# EAGLE design vaayu (EAGLE 6.6.0)
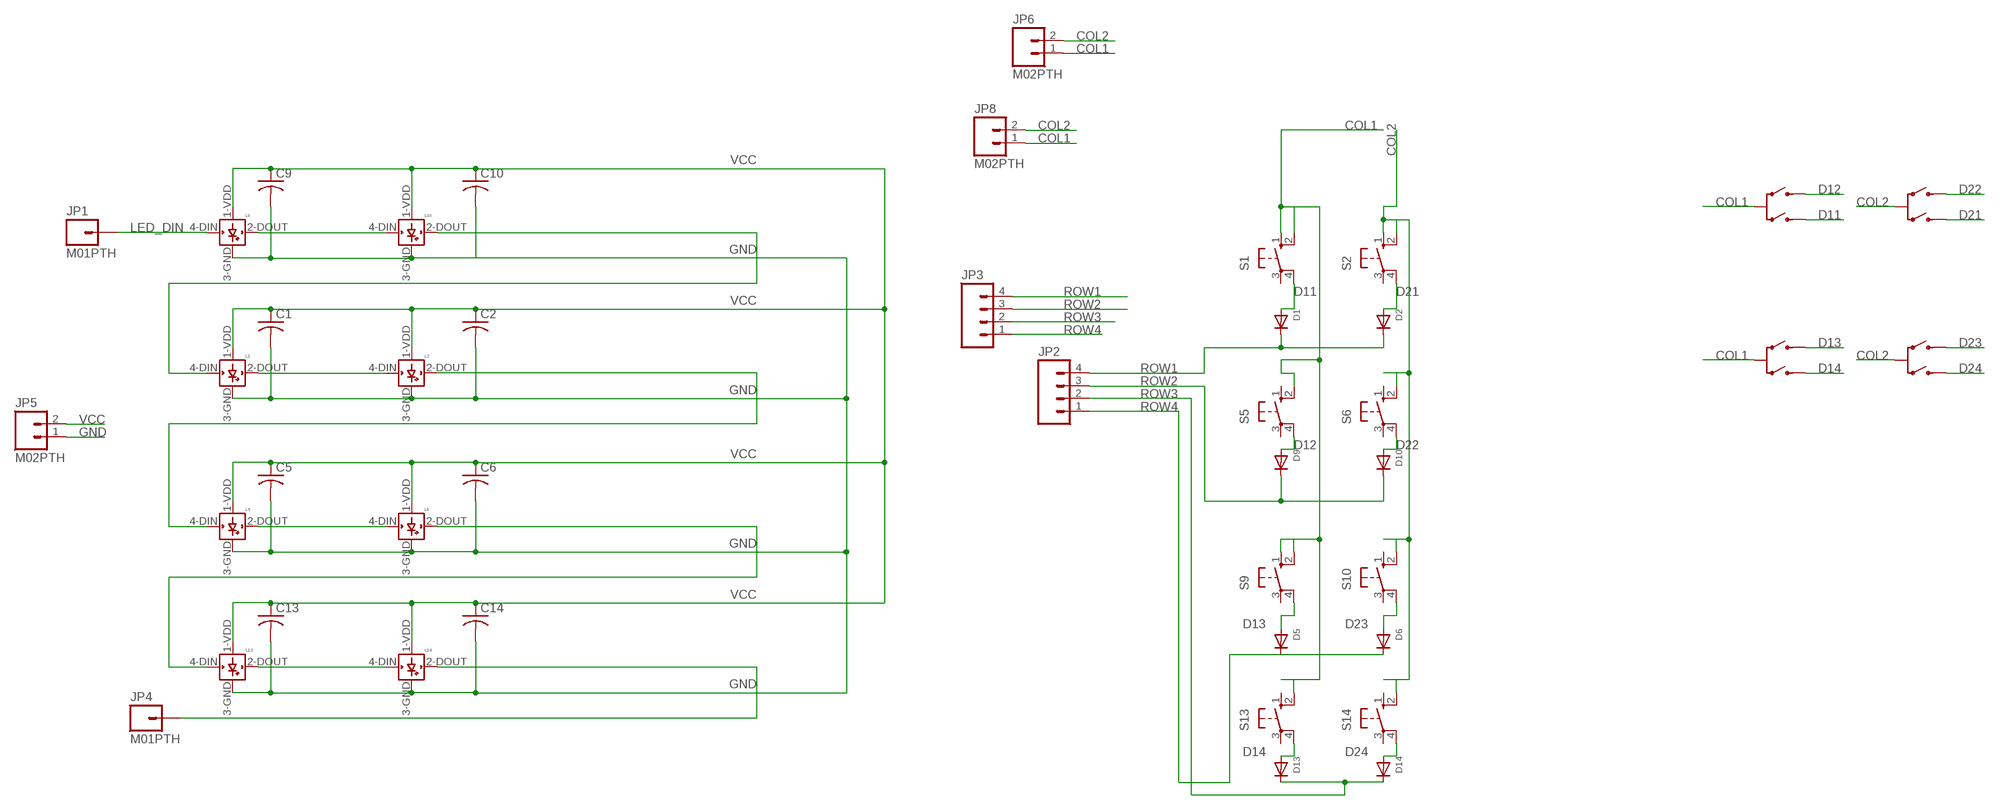
[diagram p0: schematic, sheet 1]

## Parts
C1  C-USC1206  [C1206]
C2  C-USC1206  [C1206]
C5  C-USC1206  [C1206]
C6  C-USC1206  [C1206]
C9  C-USC1206  [C1206]
C10  C-USC1206  [C1206]
C13  C-USC1206  [C1206]
C14  C-USC1206  [C1206]
D1  DIODESOD-123  [SOD-123]
D2  DIODESOD-123  [SOD-123]
D5  DIODESOD-123  [SOD-123]
D6  DIODESOD-123  [SOD-123]
D9  DIODESOD-123  [SOD-123]
D10  DIODESOD-123  [SOD-123]
D13  DIODESOD-123  [SOD-123]
D14  DIODESOD-123  [SOD-123]
JP1  M01PTH  [1X01]
JP2  M04PTH  [1X04]
JP3  M04PTH  [1X04]
JP4  M01PTH  [1X01]
JP5  M02PTH  [1X02]
JP6  M02PTH  [1X02]
JP8  M02PTH  [1X02]
L1  WS2812B  [WS2812B]
L2  WS2812B  [WS2812B]
L5  WS2812B  [WS2812B]
L6  WS2812B  [WS2812B]
L9  WS2812B  [WS2812B]
L10  WS2812B  [WS2812B]
L13  WS2812B  [WS2812B]
L14  WS2812B  [WS2812B]
S1  10-XX  [B3F-10XX]
S2  10-XX  [B3F-10XX]
S5  10-XX  [B3F-10XX]
S6  10-XX  [B3F-10XX]
S9  10-XX  [B3F-10XX]
S10  10-XX  [B3F-10XX]
S13  10-XX  [B3F-10XX]
S14  10-XX  [B3F-10XX]
U$1  ALPHA-ROT-ENCODER  [TW-700198]
U$4  ALPHA-ROT-ENCODER  [TW-700198]
U$5  ALPHA-ROT-ENCODER  [TW-700198]
U$8  ALPHA-ROT-ENCODER  [TW-700198]

## Nets
COL1: JP6.1 JP8.1 S1.1(S) S1.2(S1) S5.2(S1) S9.1(S) S9.2(S1) S13.2(S1) U$4.P2(COM) U$8.P2(COM)
COL2: JP6.2 JP8.2 S2.1(S) S2.2(S1) S6.2(S1) S10.2(S1) S14.2(S1) U$1.P2(COM) U$5.P2(COM)
D11: D1.A S1.4(P1) U$4.P1(B)
D12: D9.A S5.4(P1) U$4.P3(A)
D13: D5.A S9.4(P1) U$8.P3(A)
D14: D13.A S13.4(P1) U$8.P1(B)
D21: D2.A S2.4(P1) U$1.P1(B)
D22: D10.A S6.4(P1) U$1.P3(A)
D23: D6.A S10.4(P1) U$5.P3(A)
D24: D14.A S14.4(P1) U$5.P1(B)
GND: C1.2 C2.2 C5.2 C6.2 C9.2 C10.2 C13.2 C14.2 JP5.1 L1.3-GND(GND) L2.3-GND(GND) L5.3-GND(GND) L6.3-GND(GND) L9.3-GND(GND) L10.3-GND(GND) L13.3-GND(GND) L14.3-GND(GND)
LED_DIN: JP1.1 L9.4-DIN(DIN)
N$1: L1.2-DOUT(DOUT) L2.4-DIN(DIN)
N$4: L2.2-DOUT(DOUT) L5.4-DIN(DIN)
N$5: L5.2-DOUT(DOUT) L6.4-DIN(DIN)
N$6: L6.2-DOUT(DOUT) L13.4-DIN(DIN)
N$9: L13.2-DOUT(DOUT) L14.4-DIN(DIN)
N$10: JP4.1 L14.2-DOUT(DOUT)
N$23: L9.2-DOUT(DOUT) L10.4-DIN(DIN)
N$24: L1.4-DIN(DIN) L10.2-DOUT(DOUT)
ROW1: D1.C D2.C JP2.4 JP3.4
ROW2: D9.C D10.C JP2.3 JP3.3
ROW3: D13.C D14.C JP2.2 JP3.2
ROW4: D5.C D6.C JP2.1 JP3.1
VCC: C1.1 C2.1 C5.1 C6.1 C9.1 C10.1 C13.1 C14.1 JP5.2 L1.1-VDD(VDD) L2.1-VDD(VDD) L5.1-VDD(VDD) L6.1-VDD(VDD) L9.1-VDD(VDD) L10.1-VDD(VDD) L13.1-VDD(VDD) L14.1-VDD(VDD)
Unconnected: S1.3(P) S2.3(P) S5.1(S) S5.3(P) S6.1(S) S6.3(P) S9.3(P) S10.1(S) S10.3(P) S13.1(S) S13.3(P) S14.1(S) S14.3(P)

## Library data of the parts
C1 C2 C5 C6 C9 C10 C13 C14 = resistor:C-US: CAPACITOR, American symbol
D1 D2 D5 D6 D9 D10 D13 D14 = adafruit:DIODE: Diode SMADIODE - SMA Surface Mount Package 20V 1A Schottky Diode Digikey: 641-1014-6-ND DO-1N4148 - Through Hole Small Current Diode SOD-123 20V 1 A (.5mV Vf) Schottky Diode - Digikey: MBRX120TPMSCT-ND SOD-323 10V 570mA (.38mV Vf, 3ns) Schottky Diode - Digikey: ZLLS410CT-ND SOD-523 30V 30mA Schottky Diode (RB751S-40TE61) - Digikey: RB751S-40TE61CT-ND SOT23-R/W - SOT23 Package (R = Solder Paste/Reflow Ovens, W = Hand-Soldering) BAT54Film 40V 300mA - Digikey: 497-7162-1-ND
JP1 JP4 = SparkFun-Connectors:M01: Header 1 Standard 1-pin 0.1" header. Use with straight break away headers (SKU : PRT-00116), right angle break away headers (PRT-00553), swiss pins (PRT-00743), machine pins (PRT-00117), and female headers (PRT-00115).
JP2 JP3 = SparkFun-Connectors:M04: Header 4 Standard 4-pin 0.1" header. Use with straight break away headers (SKU : PRT-00116), right angle break away headers (PRT-00553), swiss pins (PRT-00743), machine pins (PRT-00117), and female headers (PRT-00115). Molex polarized connector foot print use with SKU : PRT-08231 with associated crimp pins and housings. 1MM SMD Version SKU: PRT-10208
JP5 JP6 JP8 = SparkFun-Connectors:M02: Standard 2-pin 0.1" header. Use with - straight break away headers ( PRT-00116) - right angle break away headers (PRT-00553) - swiss pins (PRT-00743) - machine pins (PRT-00117) - female headers (PRT-00115) Molex polarized connector foot print use with: PRT-08233 with associated crimp pins and housings. 2.54_SCREWTERM for use with PRT-10571. 3.5mm Screw Terminal footprints for PRT-08084 5mm Screw Terminal footprints for use with PRT-08432
L1 L2 L5 L6 L9 L10 L13 L14 = adafruit:WS2812B
S1 S2 S5 S6 S9 S10 S13 S14 = switch-omron:10-XX: OMRON SWITCH; MPN: B3F-1000; OC_FARNELL: 176432; OC_NEWARK: 36M3542
U$1 U$4 U$5 U$8 = RotaryEncoder:ALPHA-ROT-ENCODER

## Board
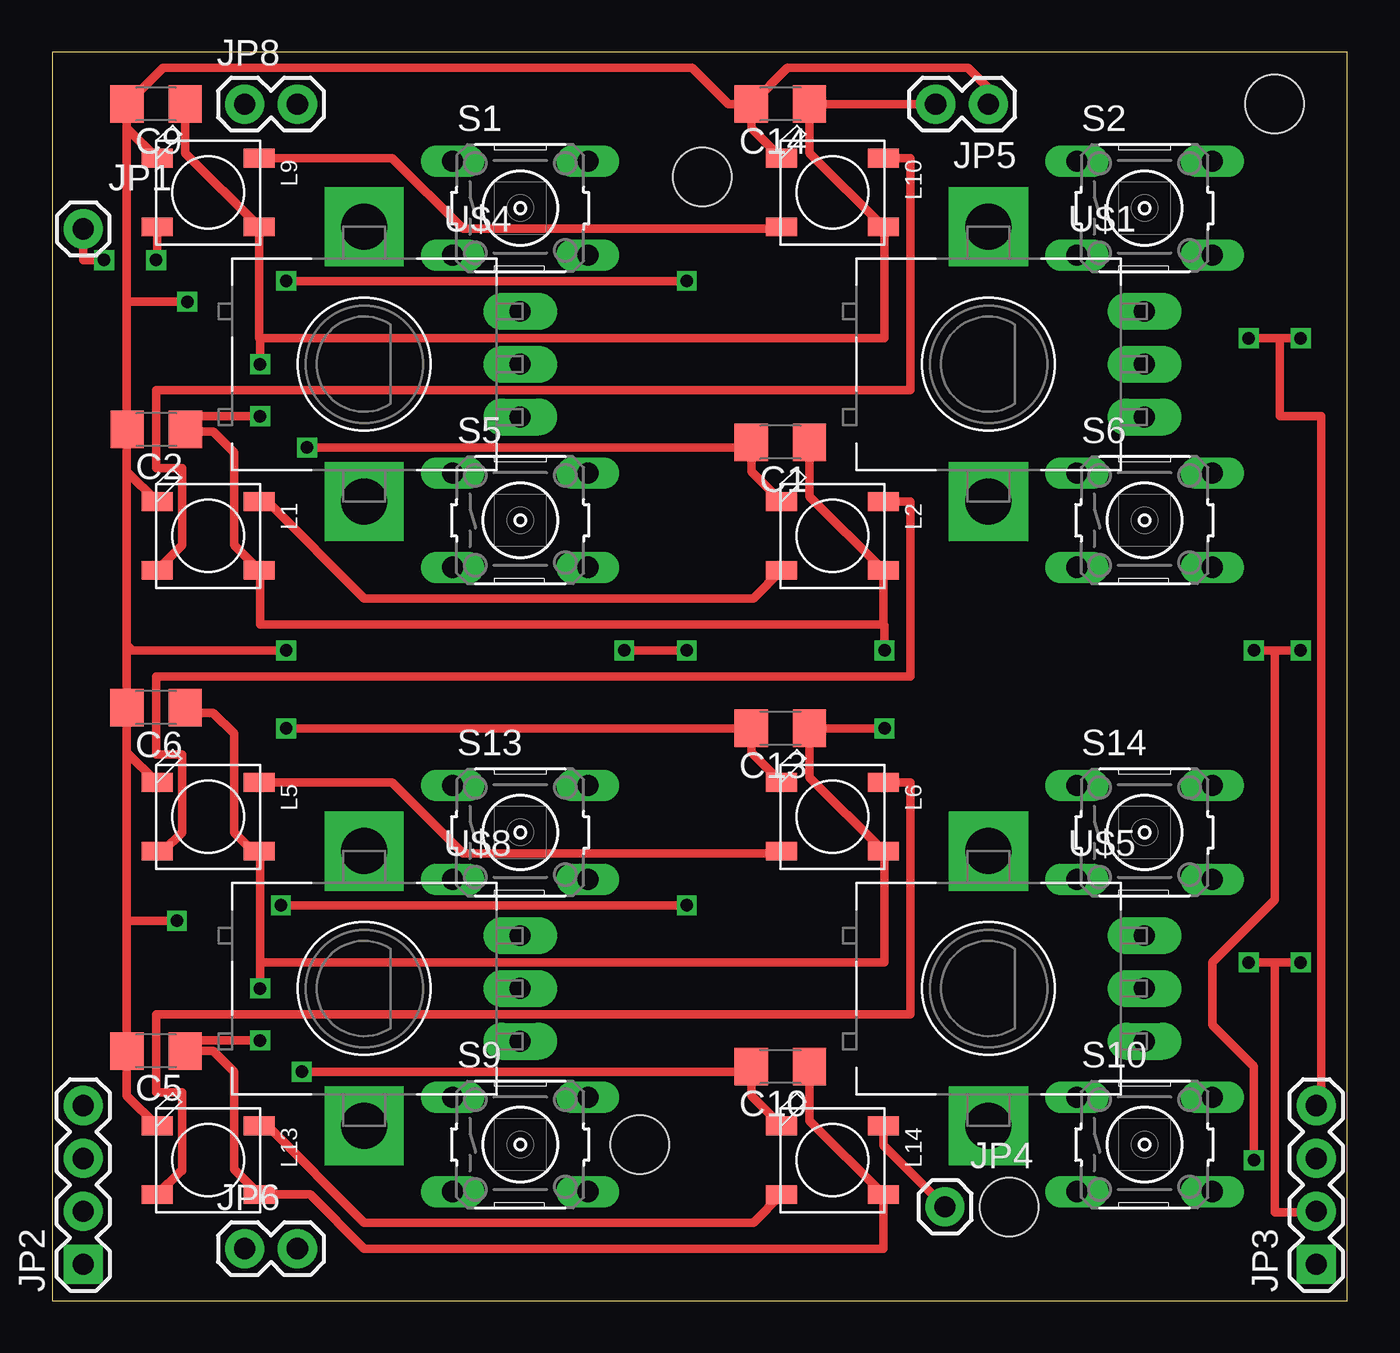
[diagram p1: board, top side]
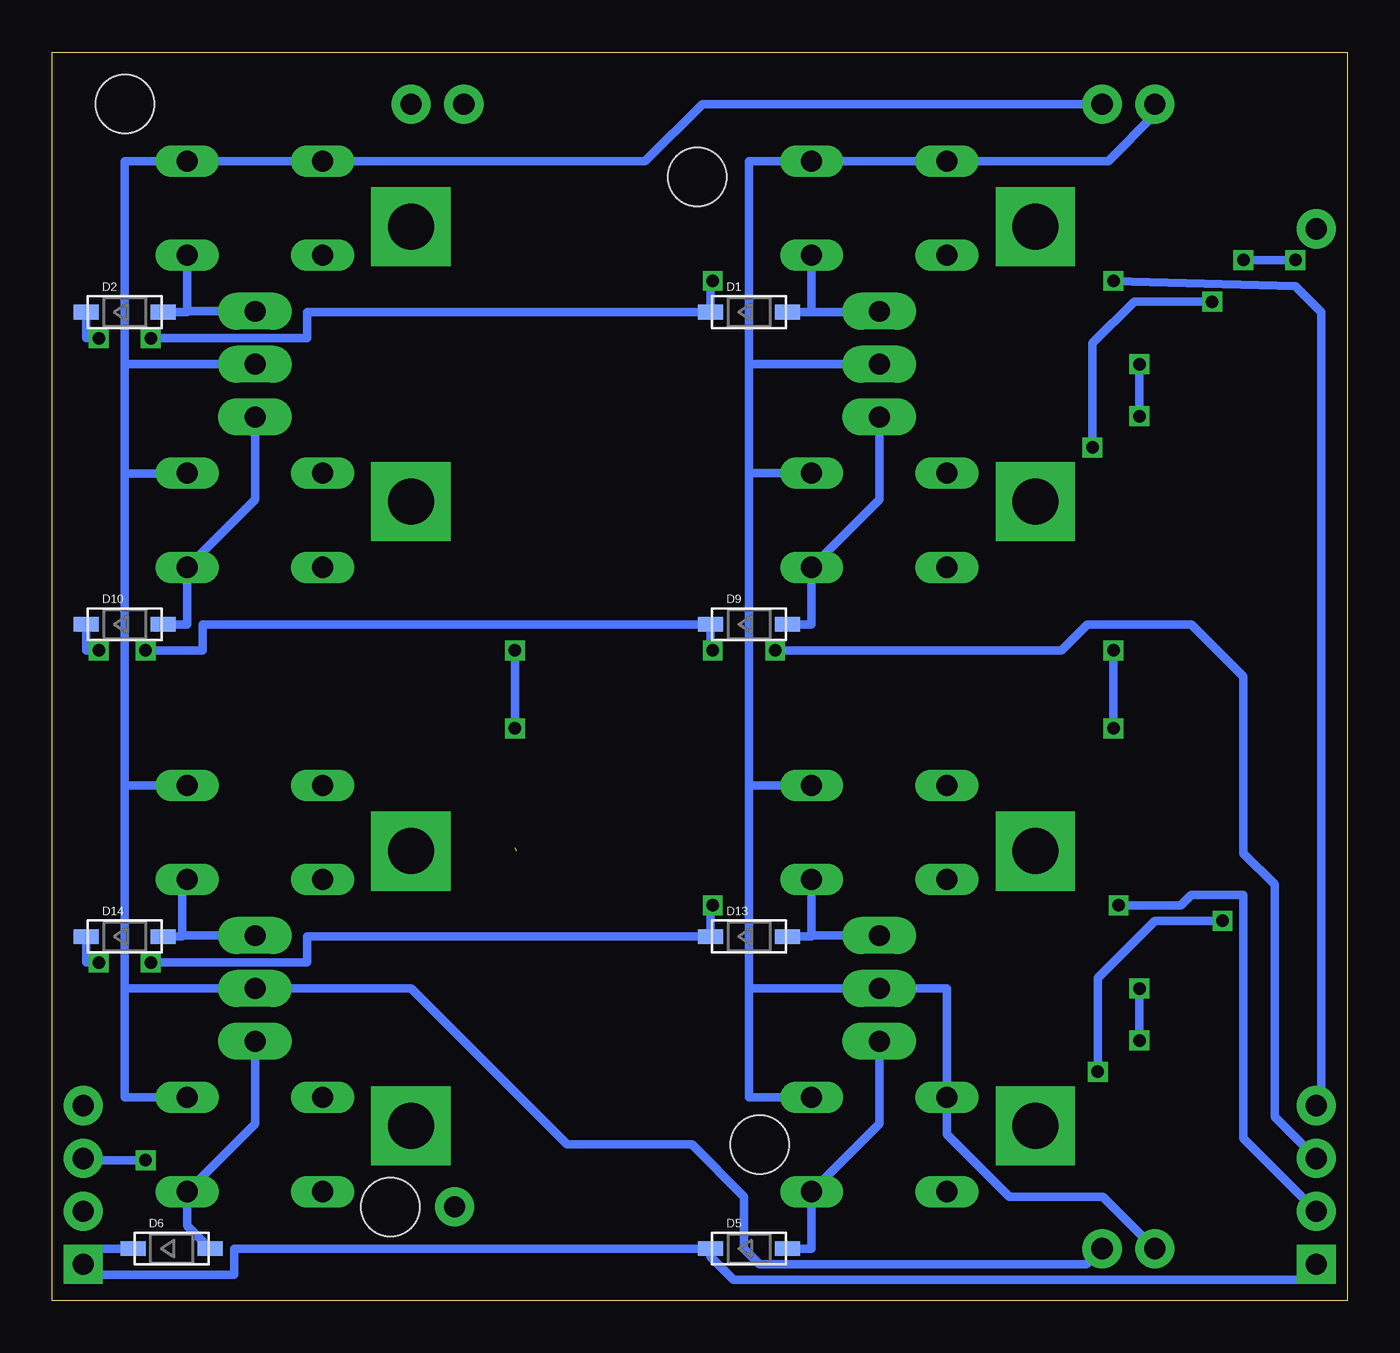
[diagram p2: board, bottom side, seen from below]

Size 62.25 x 60 mm. Coordinates in mm from the lower left corner, seen from the top.
Outline: 0,0 62.25,0 62.25,60 0,60 0,0
Copper layers (1*16): Top 0.0356mm / dielectric 1.5011mm / Bottom 0.0356mm
Design rules "LaenPCBOrder": minimum track width 6mil, minimum drill 13mil, track to track 6mil, track to pad 6mil, pad to pad 6mil, via to via 6mil, smd to smd 6mil, copper to edge 15mil, drill to drill 6mil, minimum pad ring 7mil, minimum via ring 7mil, stop-mask expansion 3mil, vias tented up to drill 0mil, thermal gap 10mil
Holes 2.8 mm at 58.75,57.5 31.25,54 28.25,7.5 46,4.5

### Footprints (pad centres in the part's own frame; a part is rotated, then mirrored left to right if it is on the bottom)
C1206 = smd 1.6 x 1.8: 1 -1.4,0; 2 1.4,0
SOD-123 = smd 1.2 x 0.7: A 1.85,0; C -1.85,0
1X01 = drill 1.016 pad 1.88: 1 0,0
1X04 = drill 1.016 pad 1.88 square: 1 0,0 | drill 1.016 pad 1.88: 2 2.54,0; 3 5.08,0; 4 7.62,0
1X02 = drill 1.016 pad 1.88: 1 0,0; 2 2.54,0
WS2812B = smd 1.5 x 0.9: 1-VDD 2.45,-1.65; 2-DOUT 2.45,1.65; 3-GND -2.45,1.65; 4-DIN -2.45,-1.65
B3F-10XX = drill 1.016 long: 1 -3.251,2.261; 2 3.251,2.261; 3 -3.251,-2.261; 4 3.251,-2.261
TW-700198 = drill 2.2 pad 3.81 square: NC1 0,6.604; NC2 0,-6.604 | drill 1 pad 1.778 long: P1 7.493,2.54; P2 7.493,0; P3 7.493,-2.54

### Placement (x,y rotation side)
C1  35,41.25 180 top
C2  5.01,41.86 180 top
C5  5,12 180 top
C6  5,28.5 180 top
C9  5,57.5 180 top
C10  35,11.25 180 top
C13  35,27.5 180 top
C14  35,57.5 180 top
D1  28.75,47.5 0 bottom
D2  58.75,47.5 0 bottom
D5  28.75,2.5 0 bottom
D6  56.5,2.5 0 bottom
D9  28.75,32.5 0 bottom
D10  58.75,32.5 0 bottom
D13  28.75,17.5 0 bottom
D14  58.75,17.5 0 bottom
JP1  1.5,51.5 0 top
JP2  1.5,1.75 90 top
JP3  60.75,1.75 90 top
JP4  42.91,4.51 0 top
JP5  45,57.5 180 top
JP6  9.25,2.5 0 top
JP8  9.25,57.5 0 top
L1  7.5,36.75 0 top
L2  37.5,36.75 0 top
L5  7.5,23.25 0 top
L6  37.5,23.25 0 top
L9  7.5,53.25 0 top
L10  37.5,53.25 0 top
L13  7.5,6.75 0 top
L14  37.5,6.75 0 top
S1  22.5,52.5 0 top
S2  52.5,52.5 0 top
S5  22.5,37.5 0 top
S6  52.5,37.5 0 top
S9  22.5,7.5 0 top
S10  52.5,7.5 0 top
S13  22.5,22.5 0 top
S14  52.5,22.5 0 top
U$1  45,45 0 top
U$4  15,45 0 top
U$5  45,15 0 top
U$8  15,15 0 top

### Tracks (layer width: path | path; a pad name or v marks a point on that pad's centre or on a via)
COL1
  Bottom 0.406: 28.75,45 28.75,54.76 S1.2 S1.1 19.24,54.75 11.5,54.75 9.25,57 JP8.1 | 28.75,45 U$4.P2 | S5.2 28.75,39.76 | 28.75,39.76 28.75,45 | 28.75,24.76 28.75,15 | 28.75,15 U$8.P2 19.25,15.01 S9.1 19.25,8 16.25,5 11.75,5 JP6.1 | S9.2 28.75,9.76 28.75,15 | S13.2 28.75,24.76 | 28.75,24.76 28.75,39.76
COL2
  Bottom 0.406: 58.75,45 58.75,54.76 S2.2 S2.1 49.24,54.75 33.75,54.75 31,57.5 JP8.2 | 58.75,45 58.75,39.75 | 58.75,39.75 S6.2 | U$1.P2 58.75,45 | S14.2 58.75,24.76 | 58.75,24.76 58.75,39.75 | 58.75,15 U$5.P2 45,15 37.5,7.5 31.5,7.5 29,5 29,2.5 28.25,1.75 12.54,1.75 JP6.2 | 58.75,15 58.75,24.76 | S10.2 58.75,9.76 58.75,15
D11
  Bottom 0.406: D1.A 25.75,47.5 | 25.75,47.5 S1.4 | 25.75,47.5 22.53,47.5 U$4.P1
D12
  Bottom 0.406: D9.A 25.75,32.5 S5.4 22.49,38.5 U$4.P3
D13
  Bottom 0.406: D5.A 25.75,2.5 S9.4 22.49,8.5 U$8.P3
D14
  Bottom 0.406: U$8.P1 25.75,17.54 | 25.75,17.54 S13.4 | D13.A 25.75,17.5 25.75,17.54
D21
  Bottom 0.406: D2.A 55.75,47.5 55.75,47.54 | 55.75,47.54 S2.4 | U$1.P1 55.75,47.54
D22
  Bottom 0.406: D10.A 55.75,32.5 S6.4 52.49,38.5 U$1.P3
D23
  Bottom 0.406: U$5.P3 52.49,8.5 S10.4 55.75,3.6 D6.A
D24
  Bottom 0.406: S14.4 56,20.24 56,17.54 | D14.A 56,17.5 56,17.54 | U$5.P1 56,17.54
GND  (via drill 0.6)
  Top 0.406: C14.2 33.6,57.35 | 3.6,39.85 L1.3-GND | L2.3-GND 33.6,39.85 C1.2 33.6,41.1 33.5,41 v12.25,41 | 3.6,56.35 C9.2 5.35,59.25 30.75,59.25 32.5,57.5 C14.2 | 3.6,56.35 L9.3-GND | L10.3-GND 33.6,56.35 33.6,57.35 | 3.6,39.85 3.6,41.84 C2.2 3.6,48 | 3.6,26.35 C6.2 3.6,31.5 | 3.6,26.35 L5.3-GND | L6.3-GND 33.6,26.35 C13.2 v11.25,27.5 | L13.3-GND 3.6,9.85 C5.2 3.6,18.25 | L14.3-GND 33.6,9.85 C10.2 33.6,11.1 33.5,11 v12,11 | 33.6,57.35 33.75,57.5 C14.2 | 3.6,18.25 3.6,26.35 | 3.6,31.5 3.6,39.85 | 3.6,48 3.6,56.35 | v11.25,31.25 3.85,31.25 3.6,31.5 | v6,18.25 3.6,18.25 | v6.5,48 3.6,48 | JP5.1 45,58.25 44,59.25 35.35,59.25 C14.2
  Bottom 0.406: v11.25,27.5 v11.25,31.25 | v12,11 12,15.5 9.25,18.25 v6,18.25 | v12.25,41 12.25,46 10.25,48 v6.5,48
LED_DIN  (via drill 0.6)
  Top 0.406: L9.4-DIN 5.05,50.05 v5,50 | v2.5,50 1.5,50 JP1.1
  Bottom 0.406: v5,50 v2.5,50
N$1
  Top 0.406: L1.2-DOUT 10.35,38.4 15,33.75 33.7,33.75 L2.4-DIN
N$4
  Top 0.406: L2.2-DOUT 41.25,38.4 41.25,30 5,30 5,26.25 6.25,26.25 6.25,22.5 5.35,21.6 L5.4-DIN
N$5
  Top 0.406: L5.2-DOUT 16.35,24.9 19.75,21.5 34.95,21.5 L6.4-DIN
N$6
  Top 0.406: L6.2-DOUT 41.25,24.9 41.25,13.75 5,13.75 5,10 6.25,10 6.25,6.25 6.2,6.25 L13.4-DIN
N$9
  Top 0.406: L13.2-DOUT 10.35,8.4 15,3.75 33.7,3.75 L14.4-DIN
N$10
  Top 0.406: L14.2-DOUT 39.95,7.47 JP4.1
N$23
  Top 0.406: L9.2-DOUT 16.35,54.9 19.75,51.5 34.95,51.5 L10.4-DIN
N$24
  Top 0.406: L10.2-DOUT 41.25,54.9 41.25,43.75 5,43.75 5,40 6.25,40 6.25,36.3 L1.4-DIN
ROW1  (via drill 0.6)
  Top 0.406: v57.5,46.25 59,46.25 | 59,46.25 v60,46.25 | 59,46.25 59,42.5 61,42.5 61,9.62 JP3.4 | v30.5,49 v11.25,49
  Bottom 0.406: v57.5,46.25 50,46.25 50,47.5 D1.C 30.6,48.65 v30.5,49 | v60,46.25 60.6,46.25 D2.C | v11.25,49 2.5,48.75 1.25,47.5 1.25,9.62 JP2.4
ROW2  (via drill 0.6)
  Top 0.406: v57.75,31.25 58.75,31.25 | 58.75,31.25 v60,31.25 | 58.75,31.25 58.75,19.25 55.75,16.25 55.75,13.25 57.75,11.25 v57.75,6.75 | v30.5,31.25 v27.5,31.25
  Bottom 0.406: D10.C 60.6,31.25 v60,31.25 | v57.75,31.25 55,31.25 55,32.5 D9.C 30.6,31.35 v30.5,31.25 | v57.75,6.75 60.67,6.75 JP3.3 | v27.5,31.25 13.75,31.25 12.5,32.5 7.5,32.5 5,30 5,21.5 3.5,20 3.5,8.83 JP2.3
ROW3  (via drill 0.6)
  Top 0.406: v57.5,16.25 58.75,16.25 | 58.75,16.25 v60,16.25 | 58.75,16.25 58.75,4.25 60.71,4.25 JP3.2 | v30.5,19 v11,19
  Bottom 0.406: v57.5,16.25 50,16.25 50,17.5 D13.C 30.6,18.9 v30.5,19 | v60,16.25 60.6,16.25 D14.C | v11,19 8,19 7.5,19.5 5,19.5 5,7.79 JP2.2
ROW4
  Bottom 0.406: D6.C 60,2.5 JP3.1 60.75,1.25 53.5,1.25 53.5,2.5 D5.C 30.6,2.1 29.5,1 2.25,1 JP2.1
VCC  (via drill 0.6)  (1 unrouted)
  Top 0.406: C9.1 6.4,55.15 L9.1-VDD 9.95,46.25 10,46.25 | 10,46.25 40,46.25 40,51.6 L10.1-VDD 36.4,55.15 C14.1 JP5.2 | C1.1 36.4,38.65 L2.1-VDD 39.95,32.5 | 39.95,32.5 10,32.5 10,35.1 L1.1-VDD 8.75,36.3 8.75,40.75 7.75,41.75 6.53,41.75 C2.1 6.42,42.5 v10,42.5 | L6.1-VDD 36.4,25.15 C13.1 v40,27.5 | C10.1 36.4,8.65 L14.1-VDD 39.95,2.5 15,2.5 12.4,5.1 L13.1-VDD 8.75,6.3 8.75,11 7.75,12 C5.1 6.4,12.5 v10,12.5 | v40,31.25 40,32.45 39.95,32.5 | 6.65,28.75 C6.1 6.65,28.25 7.75,28.25 8.75,27.25 8.75,22.5 9.65,21.6 L5.1-VDD 10,21.6 10,16.25 | 10,16.25 40,16.25 40,21.75 | 10,46.25 v10,45 | 10,16.25 v10,15
  Bottom 0.406: v40,27.5 v40,31.25 | v10,45 v10,42.5 | v10,15 v10,12.5